# EAGLE design brain2_v12 (EAGLE 9.5.2)

## Sheet 1 of 2
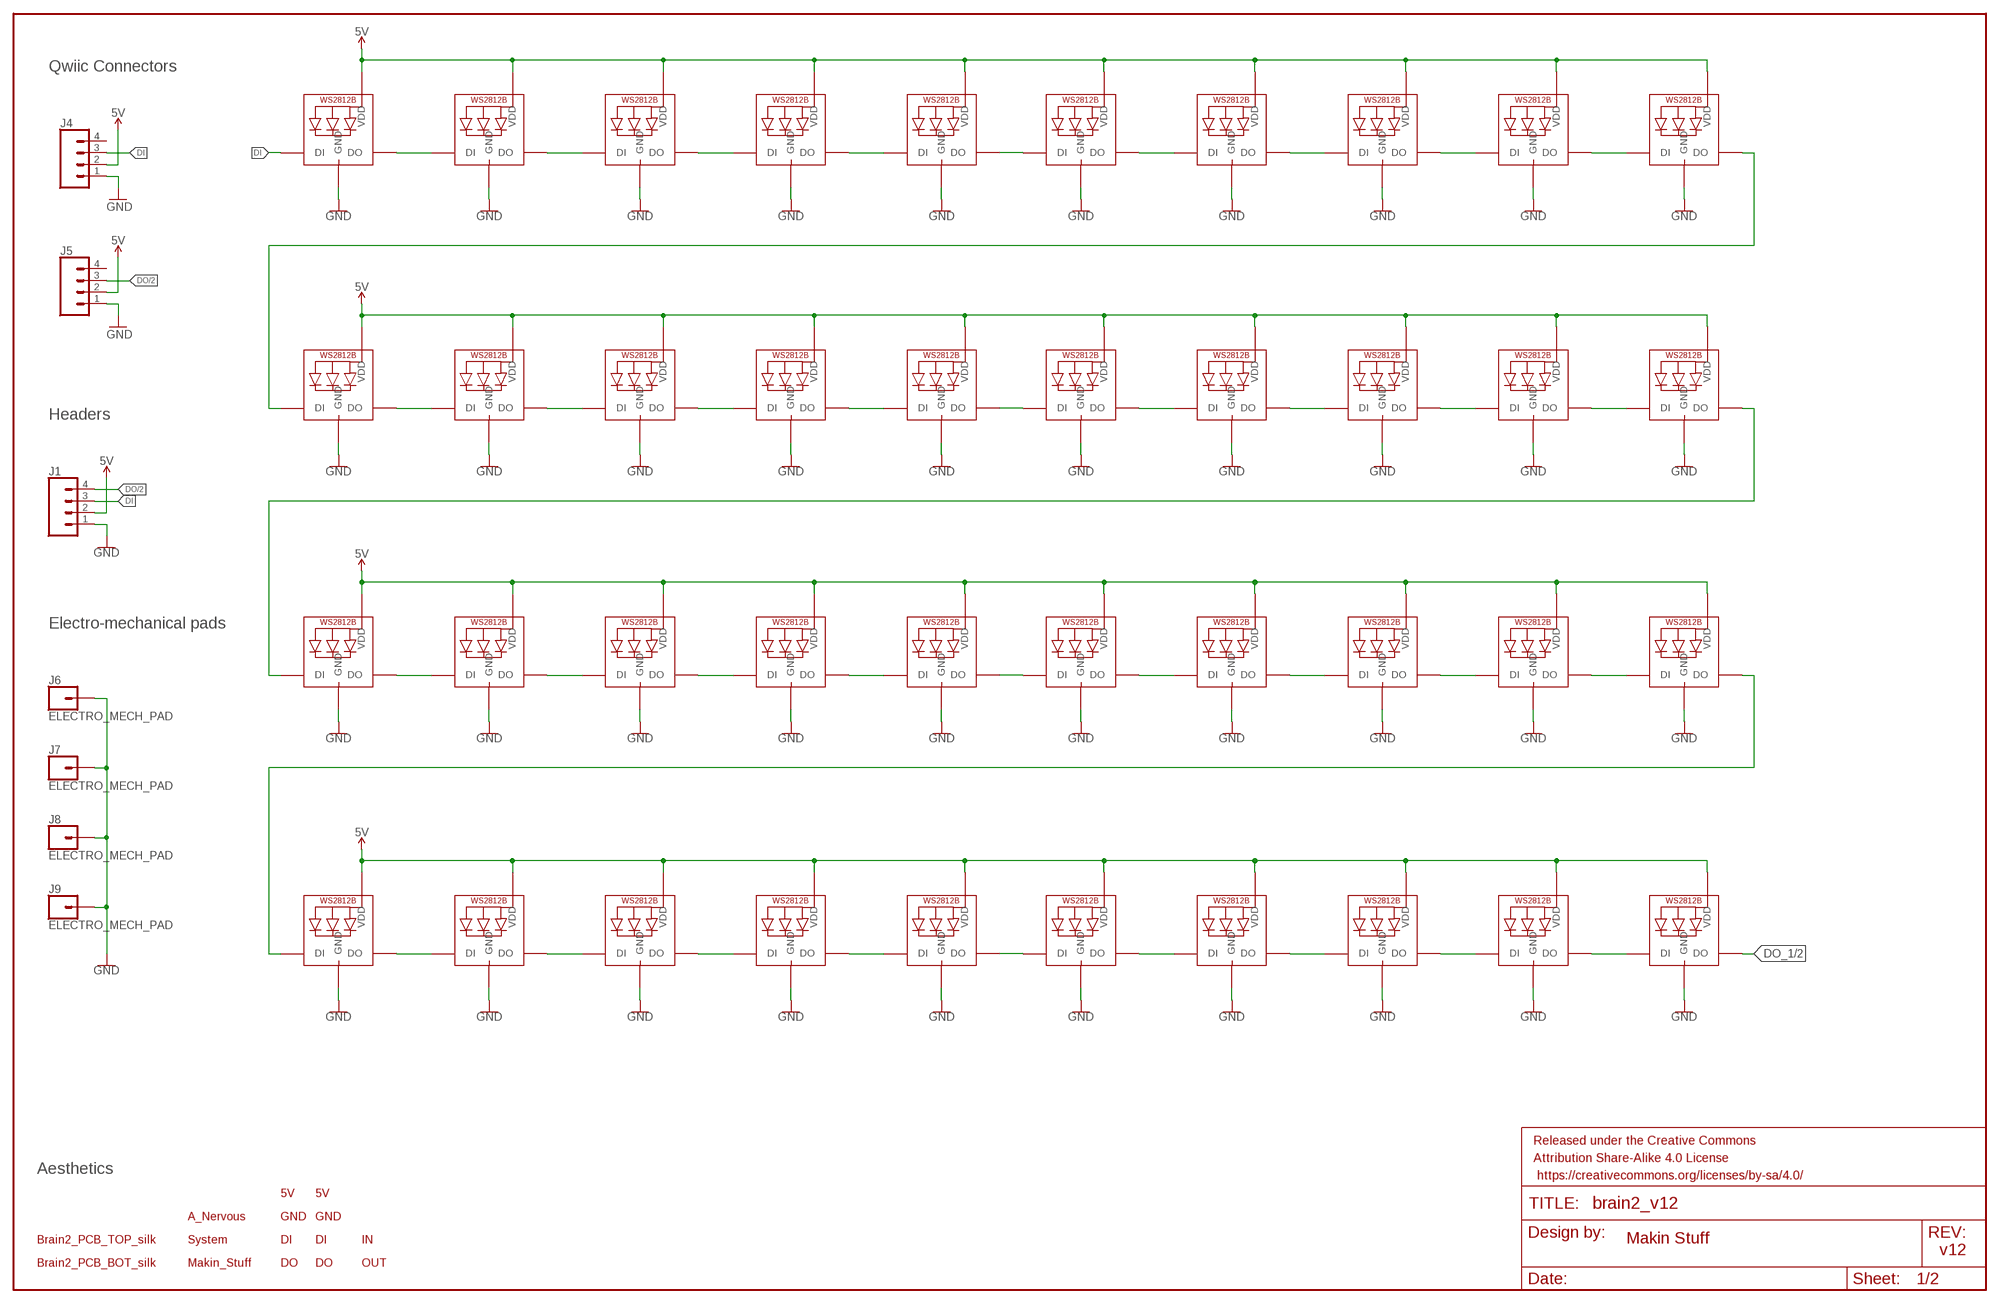
[diagram p0: schematic, sheet 1]

### Parts
FRAME2  FRAME-LEDGER  [CREATIVE_COMMONS]
J1  CONN_041X04_NO_SILK_NO_POP  [1X04_NO_SILK]
J4  CONN_04SMD3  [JST04_1MM_RA]
J5  CONN_04SMD3  [JST04_1MM_RA]
J6  ELECTRO_MECH_PAD  [5X3_SOLDER_PAD]
J7  ELECTRO_MECH_PAD  [5X3_SOLDER_PAD]
J8  ELECTRO_MECH_PAD  [5X3_SOLDER_PAD]
J9  ELECTRO_MECH_PAD  [5X3_SOLDER_PAD]
LED1  3.5X3.5_RGB_LED3.5X3.5  [3.5X3.5_RGB_LED]
LED2  3.5X3.5_RGB_LED3.5X3.5  [3.5X3.5_RGB_LED]
LED3  3.5X3.5_RGB_LED3.5X3.5  [3.5X3.5_RGB_LED]
LED4  3.5X3.5_RGB_LED3.5X3.5  [3.5X3.5_RGB_LED]
LED5  3.5X3.5_RGB_LED3.5X3.5  [3.5X3.5_RGB_LED]
LED6  3.5X3.5_RGB_LED3.5X3.5  [3.5X3.5_RGB_LED]
LED7  3.5X3.5_RGB_LED3.5X3.5  [3.5X3.5_RGB_LED]
LED8  3.5X3.5_RGB_LED3.5X3.5  [3.5X3.5_RGB_LED]
LED9  3.5X3.5_RGB_LED3.5X3.5  [3.5X3.5_RGB_LED]
LED10  3.5X3.5_RGB_LED3.5X3.5  [3.5X3.5_RGB_LED]
LED11  3.5X3.5_RGB_LED3.5X3.5  [3.5X3.5_RGB_LED]
LED12  3.5X3.5_RGB_LED3.5X3.5  [3.5X3.5_RGB_LED]
LED13  3.5X3.5_RGB_LED3.5X3.5  [3.5X3.5_RGB_LED]
LED14  3.5X3.5_RGB_LED3.5X3.5  [3.5X3.5_RGB_LED]
LED15  3.5X3.5_RGB_LED3.5X3.5  [3.5X3.5_RGB_LED]
LED16  3.5X3.5_RGB_LED3.5X3.5  [3.5X3.5_RGB_LED]
LED17  3.5X3.5_RGB_LED3.5X3.5  [3.5X3.5_RGB_LED]
LED18  3.5X3.5_RGB_LED3.5X3.5  [3.5X3.5_RGB_LED]
LED19  3.5X3.5_RGB_LED3.5X3.5  [3.5X3.5_RGB_LED]
LED20  3.5X3.5_RGB_LED3.5X3.5  [3.5X3.5_RGB_LED]
LED21  3.5X3.5_RGB_LED3.5X3.5  [3.5X3.5_RGB_LED]
LED22  3.5X3.5_RGB_LED3.5X3.5  [3.5X3.5_RGB_LED]
LED23  3.5X3.5_RGB_LED3.5X3.5  [3.5X3.5_RGB_LED]
LED24  3.5X3.5_RGB_LED3.5X3.5  [3.5X3.5_RGB_LED]
LED25  3.5X3.5_RGB_LED3.5X3.5  [3.5X3.5_RGB_LED]
LED26  3.5X3.5_RGB_LED3.5X3.5  [3.5X3.5_RGB_LED]
LED27  3.5X3.5_RGB_LED3.5X3.5  [3.5X3.5_RGB_LED]
LED28  3.5X3.5_RGB_LED3.5X3.5  [3.5X3.5_RGB_LED]
LED29  3.5X3.5_RGB_LED3.5X3.5  [3.5X3.5_RGB_LED]
LED30  3.5X3.5_RGB_LED3.5X3.5  [3.5X3.5_RGB_LED]
LED31  3.5X3.5_RGB_LED3.5X3.5  [3.5X3.5_RGB_LED]
LED32  3.5X3.5_RGB_LED3.5X3.5  [3.5X3.5_RGB_LED]
LED33  3.5X3.5_RGB_LED3.5X3.5  [3.5X3.5_RGB_LED]
LED34  3.5X3.5_RGB_LED3.5X3.5  [3.5X3.5_RGB_LED]
LED35  3.5X3.5_RGB_LED3.5X3.5  [3.5X3.5_RGB_LED]
LED36  3.5X3.5_RGB_LED3.5X3.5  [3.5X3.5_RGB_LED]
LED37  3.5X3.5_RGB_LED3.5X3.5  [3.5X3.5_RGB_LED]
LED38  3.5X3.5_RGB_LED3.5X3.5  [3.5X3.5_RGB_LED]
LED39  3.5X3.5_RGB_LED3.5X3.5  [3.5X3.5_RGB_LED]
LED40  3.5X3.5_RGB_LED3.5X3.5  [3.5X3.5_RGB_LED]
U$1  A_NERVOUS0  [A_NERVOUS0]
U$2  SYSTEM1  [SYSTEM1]
U$3  MAKIN_STUFF2  [MAKIN_STUFF2]
U$4  5V1  [5V1]
U$5  5V1  [5V1]
U$6  GND0  [GND0]
U$7  GND0  [GND0]
U$8  DI0  [DI0]
U$9  DI0  [DI0]
U$10  DO3  [DO3]
U$11  DO3  [DO3]
U$12  IN0  [IN0]
U$13  OUT1  [OUT1]
U$14  BRAIN2_PCB_TOP_SILK  [BRAIN2_PCB_TOP_SILK]
U$15  BRAIN2_PCB_BOT_SILK  [BRAIN2_PCB_BOT_SILK]

### Nets
5V: J1.2 J4.2 J5.2 LED1.4(VDD) LED2.4(VDD) LED3.4(VDD) LED4.4(VDD) LED5.4(VDD) LED6.4(VDD) LED7.4(VDD) LED8.4(VDD) LED9.4(VDD) LED10.4(VDD) LED11.4(VDD) LED12.4(VDD) LED13.4(VDD) LED14.4(VDD) LED15.4(VDD) LED16.4(VDD) LED17.4(VDD) LED18.4(VDD) LED19.4(VDD) LED20.4(VDD) LED21.4(VDD) LED22.4(VDD) LED23.4(VDD) LED24.4(VDD) LED25.4(VDD) LED26.4(VDD) LED27.4(VDD) LED28.4(VDD) LED29.4(VDD) LED30.4(VDD) LED31.4(VDD) LED32.4(VDD) LED33.4(VDD) LED34.4(VDD) LED35.4(VDD) LED36.4(VDD) LED37.4(VDD) LED38.4(VDD) LED39.4(VDD) LED40.4(VDD) ; also sheet 2
DI: J1.3 J4.3 LED1.3(DI)
DO: J1.4 J5.3 ; also sheet 2
DO_1: LED40.1(DO) ; also sheet 2
GND: J1.1 J4.1 J5.1 J6.P$1 J7.P$1 J8.P$1 J9.P$1 LED1.2(GND) LED2.2(GND) LED3.2(GND) LED4.2(GND) LED5.2(GND) LED6.2(GND) LED7.2(GND) LED8.2(GND) LED9.2(GND) LED10.2(GND) LED11.2(GND) LED12.2(GND) LED13.2(GND) LED14.2(GND) LED15.2(GND) LED16.2(GND) LED17.2(GND) LED18.2(GND) LED19.2(GND) LED20.2(GND) LED21.2(GND) LED22.2(GND) LED23.2(GND) LED24.2(GND) LED25.2(GND) LED26.2(GND) LED27.2(GND) LED28.2(GND) LED29.2(GND) LED30.2(GND) LED31.2(GND) LED32.2(GND) LED33.2(GND) LED34.2(GND) LED35.2(GND) LED36.2(GND) LED37.2(GND) LED38.2(GND) LED39.2(GND) LED40.2(GND) ; also sheet 2
N$1: LED1.1(DO) LED2.3(DI)
N$2: LED2.1(DO) LED3.3(DI)
N$3: LED3.1(DO) LED4.3(DI)
N$4: LED4.1(DO) LED5.3(DI)
N$5: LED6.1(DO) LED7.3(DI)
N$6: LED7.1(DO) LED8.3(DI)
N$7: LED8.1(DO) LED9.3(DI)
N$8: LED9.1(DO) LED10.3(DI)
N$9: LED11.1(DO) LED12.3(DI)
N$10: LED5.1(DO) LED6.3(DI)
N$11: LED12.1(DO) LED13.3(DI)
N$12: LED13.1(DO) LED14.3(DI)
N$13: LED14.1(DO) LED15.3(DI)
N$14: LED16.1(DO) LED17.3(DI)
N$15: LED17.1(DO) LED18.3(DI)
N$16: LED18.1(DO) LED19.3(DI)
N$17: LED19.1(DO) LED20.3(DI)
N$18: LED15.1(DO) LED16.3(DI)
N$19: LED21.1(DO) LED22.3(DI)
N$20: LED22.1(DO) LED23.3(DI)
N$21: LED23.1(DO) LED24.3(DI)
N$22: LED24.1(DO) LED25.3(DI)
N$23: LED26.1(DO) LED27.3(DI)
N$24: LED27.1(DO) LED28.3(DI)
N$25: LED28.1(DO) LED29.3(DI)
N$26: LED29.1(DO) LED30.3(DI)
N$27: LED25.1(DO) LED26.3(DI)
N$28: LED31.1(DO) LED32.3(DI)
N$29: LED32.1(DO) LED33.3(DI)
N$30: LED33.1(DO) LED34.3(DI)
N$31: LED34.1(DO) LED35.3(DI)
N$32: LED36.1(DO) LED37.3(DI)
N$33: LED37.1(DO) LED38.3(DI)
N$34: LED38.1(DO) LED39.3(DI)
N$35: LED39.1(DO) LED40.3(DI)
N$36: LED35.1(DO) LED36.3(DI)
N$37: LED10.1(DO) LED11.3(DI)
N$38: LED20.1(DO) LED21.3(DI)
N$39: LED30.1(DO) LED31.3(DI)
Unconnected: J4.4 J5.4

### Notes on the sheet
- Qwiic Connectors
- Headers
- Electro-mechanical pads
- Aesthetics
- Makin Stuff
- v12

## Sheet 2 of 2
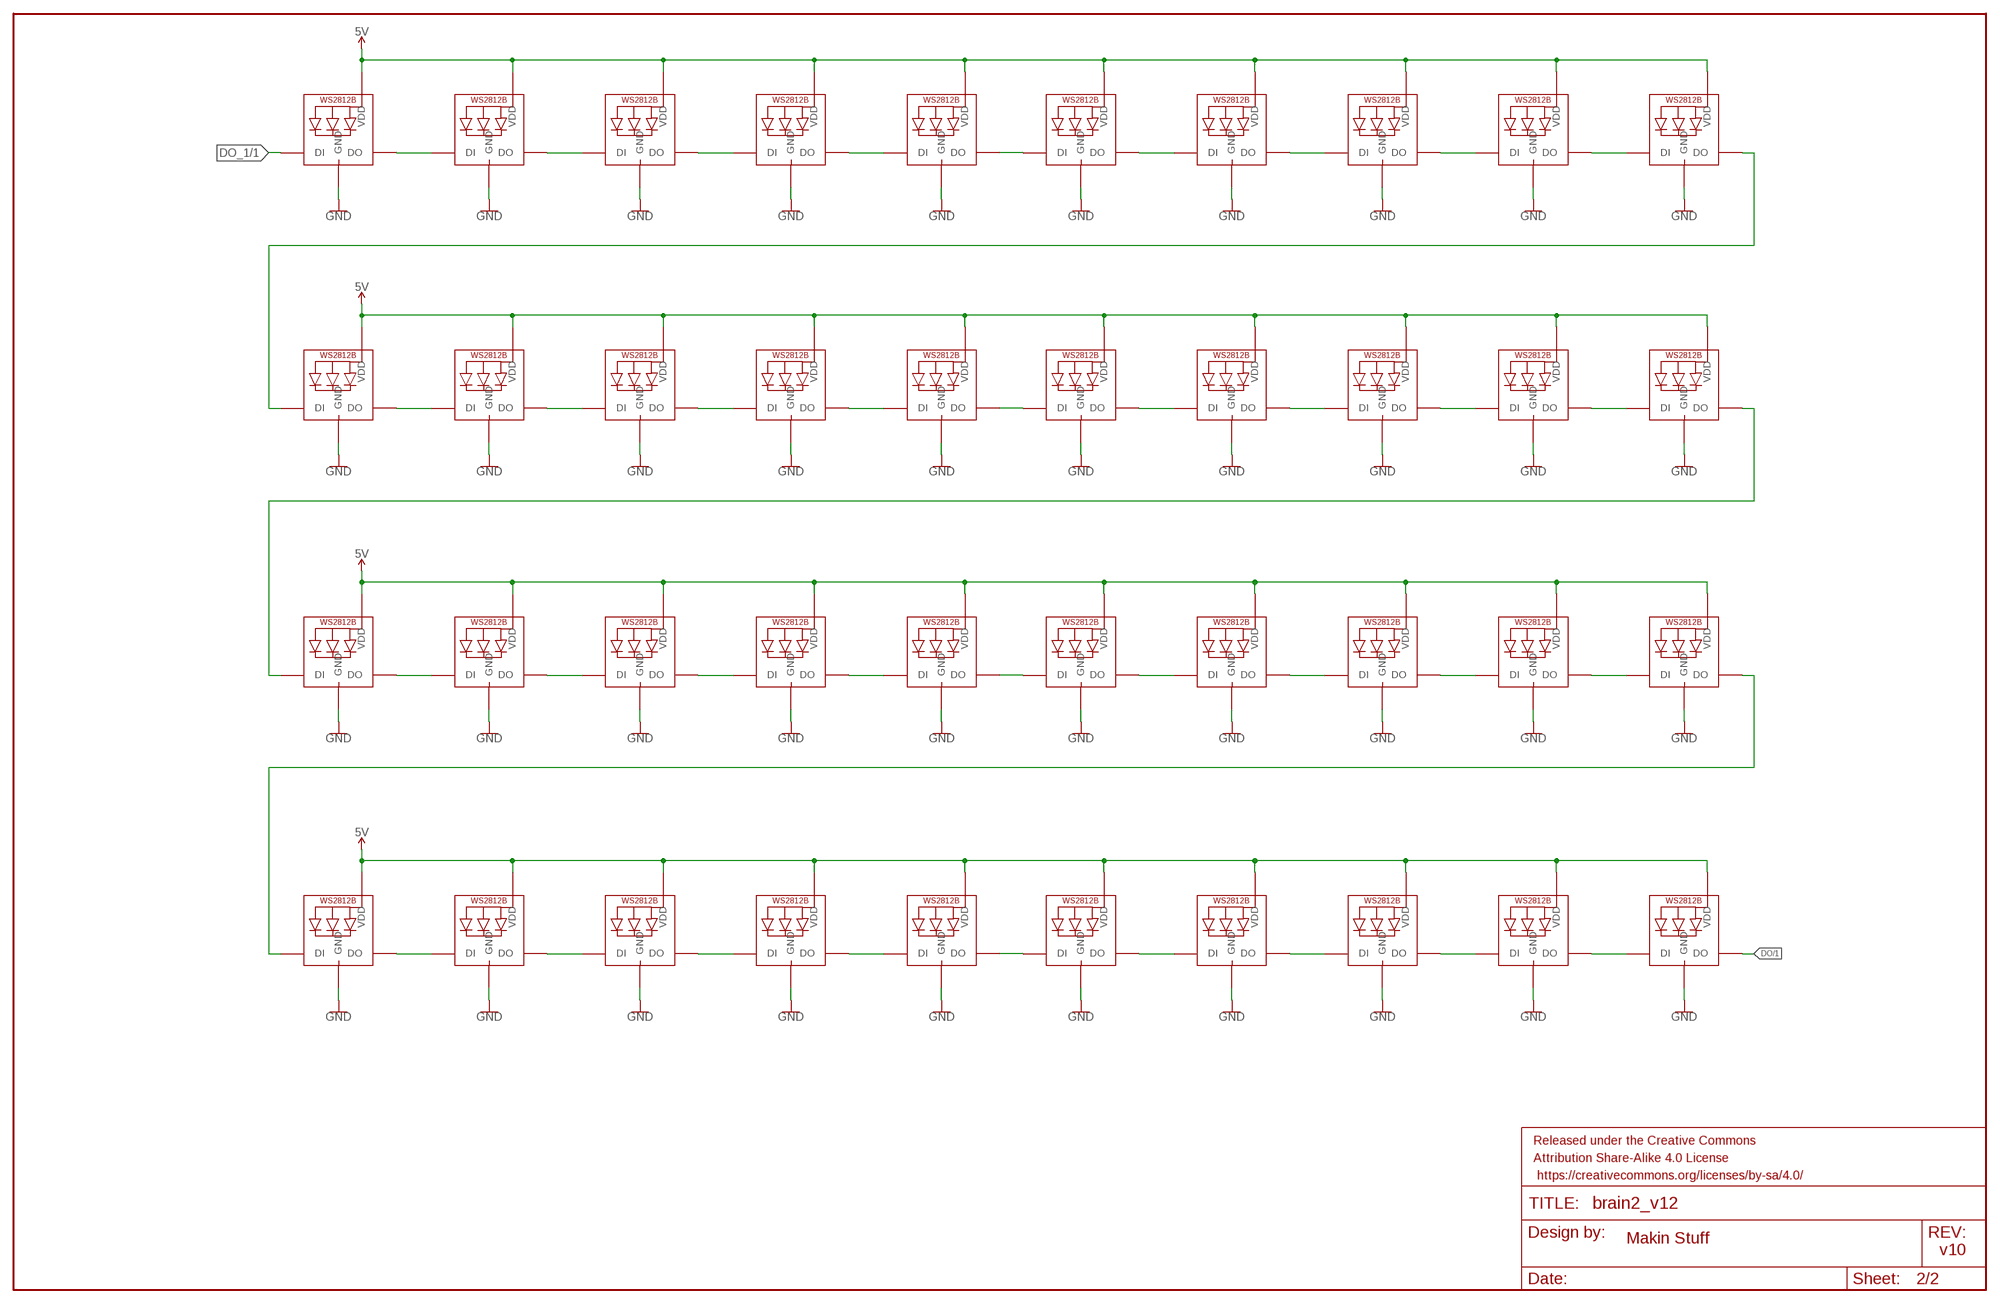
[diagram p1: schematic, sheet 2]

### Parts
FRAME1  FRAME-LEDGER  [CREATIVE_COMMONS]
FRAME3  FRAME-LEDGER  [CREATIVE_COMMONS]
LED41  3.5X3.5_RGB_LED3.5X3.5  [3.5X3.5_RGB_LED]
LED42  3.5X3.5_RGB_LED3.5X3.5  [3.5X3.5_RGB_LED]
LED43  3.5X3.5_RGB_LED3.5X3.5  [3.5X3.5_RGB_LED]
LED44  3.5X3.5_RGB_LED3.5X3.5  [3.5X3.5_RGB_LED]
LED45  3.5X3.5_RGB_LED3.5X3.5  [3.5X3.5_RGB_LED]
LED46  3.5X3.5_RGB_LED3.5X3.5  [3.5X3.5_RGB_LED]
LED47  3.5X3.5_RGB_LED3.5X3.5  [3.5X3.5_RGB_LED]
LED48  3.5X3.5_RGB_LED3.5X3.5  [3.5X3.5_RGB_LED]
LED49  3.5X3.5_RGB_LED3.5X3.5  [3.5X3.5_RGB_LED]
LED50  3.5X3.5_RGB_LED3.5X3.5  [3.5X3.5_RGB_LED]
LED51  3.5X3.5_RGB_LED3.5X3.5  [3.5X3.5_RGB_LED]
LED52  3.5X3.5_RGB_LED3.5X3.5  [3.5X3.5_RGB_LED]
LED53  3.5X3.5_RGB_LED3.5X3.5  [3.5X3.5_RGB_LED]
LED54  3.5X3.5_RGB_LED3.5X3.5  [3.5X3.5_RGB_LED]
LED55  3.5X3.5_RGB_LED3.5X3.5  [3.5X3.5_RGB_LED]
LED56  3.5X3.5_RGB_LED3.5X3.5  [3.5X3.5_RGB_LED]
LED57  3.5X3.5_RGB_LED3.5X3.5  [3.5X3.5_RGB_LED]
LED58  3.5X3.5_RGB_LED3.5X3.5  [3.5X3.5_RGB_LED]
LED59  3.5X3.5_RGB_LED3.5X3.5  [3.5X3.5_RGB_LED]
LED60  3.5X3.5_RGB_LED3.5X3.5  [3.5X3.5_RGB_LED]
LED61  3.5X3.5_RGB_LED3.5X3.5  [3.5X3.5_RGB_LED]
LED62  3.5X3.5_RGB_LED3.5X3.5  [3.5X3.5_RGB_LED]
LED63  3.5X3.5_RGB_LED3.5X3.5  [3.5X3.5_RGB_LED]
LED64  3.5X3.5_RGB_LED3.5X3.5  [3.5X3.5_RGB_LED]
LED65  3.5X3.5_RGB_LED3.5X3.5  [3.5X3.5_RGB_LED]
LED66  3.5X3.5_RGB_LED3.5X3.5  [3.5X3.5_RGB_LED]
LED67  3.5X3.5_RGB_LED3.5X3.5  [3.5X3.5_RGB_LED]
LED68  3.5X3.5_RGB_LED3.5X3.5  [3.5X3.5_RGB_LED]
LED69  3.5X3.5_RGB_LED3.5X3.5  [3.5X3.5_RGB_LED]
LED70  3.5X3.5_RGB_LED3.5X3.5  [3.5X3.5_RGB_LED]
LED71  3.5X3.5_RGB_LED3.5X3.5  [3.5X3.5_RGB_LED]
LED72  3.5X3.5_RGB_LED3.5X3.5  [3.5X3.5_RGB_LED]
LED73  3.5X3.5_RGB_LED3.5X3.5  [3.5X3.5_RGB_LED]
LED74  3.5X3.5_RGB_LED3.5X3.5  [3.5X3.5_RGB_LED]
LED75  3.5X3.5_RGB_LED3.5X3.5  [3.5X3.5_RGB_LED]
LED76  3.5X3.5_RGB_LED3.5X3.5  [3.5X3.5_RGB_LED]
LED77  3.5X3.5_RGB_LED3.5X3.5  [3.5X3.5_RGB_LED]
LED78  3.5X3.5_RGB_LED3.5X3.5  [3.5X3.5_RGB_LED]
LED79  3.5X3.5_RGB_LED3.5X3.5  [3.5X3.5_RGB_LED]
LED80  3.5X3.5_RGB_LED3.5X3.5  [3.5X3.5_RGB_LED]

### Nets
5V: LED41.4(VDD) LED42.4(VDD) LED43.4(VDD) LED44.4(VDD) LED45.4(VDD) LED46.4(VDD) LED47.4(VDD) LED48.4(VDD) LED49.4(VDD) LED50.4(VDD) LED51.4(VDD) LED52.4(VDD) LED53.4(VDD) LED54.4(VDD) LED55.4(VDD) LED56.4(VDD) LED57.4(VDD) LED58.4(VDD) LED59.4(VDD) LED60.4(VDD) LED61.4(VDD) LED62.4(VDD) LED63.4(VDD) LED64.4(VDD) LED65.4(VDD) LED66.4(VDD) LED67.4(VDD) LED68.4(VDD) LED69.4(VDD) LED70.4(VDD) LED71.4(VDD) LED72.4(VDD) LED73.4(VDD) LED74.4(VDD) LED75.4(VDD) LED76.4(VDD) LED77.4(VDD) LED78.4(VDD) LED79.4(VDD) LED80.4(VDD) ; also sheet 1
DO: LED80.1(DO) ; also sheet 1
DO_1: LED41.3(DI) ; also sheet 1
GND: LED41.2(GND) LED42.2(GND) LED43.2(GND) LED44.2(GND) LED45.2(GND) LED46.2(GND) LED47.2(GND) LED48.2(GND) LED49.2(GND) LED50.2(GND) LED51.2(GND) LED52.2(GND) LED53.2(GND) LED54.2(GND) LED55.2(GND) LED56.2(GND) LED57.2(GND) LED58.2(GND) LED59.2(GND) LED60.2(GND) LED61.2(GND) LED62.2(GND) LED63.2(GND) LED64.2(GND) LED65.2(GND) LED66.2(GND) LED67.2(GND) LED68.2(GND) LED69.2(GND) LED70.2(GND) LED71.2(GND) LED72.2(GND) LED73.2(GND) LED74.2(GND) LED75.2(GND) LED76.2(GND) LED77.2(GND) LED78.2(GND) LED79.2(GND) LED80.2(GND) ; also sheet 1
N$40: LED41.1(DO) LED42.3(DI)
N$41: LED42.1(DO) LED43.3(DI)
N$42: LED43.1(DO) LED44.3(DI)
N$43: LED44.1(DO) LED45.3(DI)
N$44: LED46.1(DO) LED47.3(DI)
N$45: LED47.1(DO) LED48.3(DI)
N$46: LED48.1(DO) LED49.3(DI)
N$47: LED49.1(DO) LED50.3(DI)
N$48: LED45.1(DO) LED46.3(DI)
N$49: LED51.1(DO) LED52.3(DI)
N$50: LED52.1(DO) LED53.3(DI)
N$51: LED53.1(DO) LED54.3(DI)
N$52: LED54.1(DO) LED55.3(DI)
N$53: LED56.1(DO) LED57.3(DI)
N$54: LED57.1(DO) LED58.3(DI)
N$55: LED58.1(DO) LED59.3(DI)
N$56: LED59.1(DO) LED60.3(DI)
N$57: LED55.1(DO) LED56.3(DI)
N$58: LED61.1(DO) LED62.3(DI)
N$59: LED62.1(DO) LED63.3(DI)
N$60: LED63.1(DO) LED64.3(DI)
N$61: LED64.1(DO) LED65.3(DI)
N$62: LED66.1(DO) LED67.3(DI)
N$63: LED67.1(DO) LED68.3(DI)
N$64: LED68.1(DO) LED69.3(DI)
N$65: LED69.1(DO) LED70.3(DI)
N$66: LED65.1(DO) LED66.3(DI)
N$67: LED71.1(DO) LED72.3(DI)
N$68: LED72.1(DO) LED73.3(DI)
N$69: LED73.1(DO) LED74.3(DI)
N$70: LED74.1(DO) LED75.3(DI)
N$71: LED76.1(DO) LED77.3(DI)
N$72: LED77.1(DO) LED78.3(DI)
N$73: LED78.1(DO) LED79.3(DI)
N$74: LED79.1(DO) LED80.3(DI)
N$75: LED75.1(DO) LED76.3(DI)
N$76: LED50.1(DO) LED51.3(DI)
N$77: LED60.1(DO) LED61.3(DI)
N$78: LED70.1(DO) LED71.3(DI)

### Notes on the sheet
- Makin Stuff
- v10

## Library data of the parts
FRAME1-FRAME3 = SparkFun-Aesthetics:FRAME-LEDGER: Schematic Frame - Ledger Standard 11x14 US Ledger frame
J1 = SparkFun-Connectors:CONN_04: Multi connection point. Often used as Generic Header-pin footprint for 0.1 inch spaced/style header connections On any of the 0.1 inch spaced packages, you can populate with these: Break Away Headers - Straight (PRT-00116) Break Away Male Headers - Right Angle (PRT-00553) Female Headers (PRT-00115) Break Away Headers - Machine Pin (PRT-00117) Break Away Female Headers - Swiss Machine Pin (PRT-00743) For SCREWTERMINALS and SPRING TERMINALS visit here: Screw Terimnals on SparkFun.com (5mm/3.5mm/2.54mm spacing) This device is also useful as a general connection point to wire up your design to another part of your project. Our various solder wires solder well into these plated through hole pads. Hook-Up Wire - Assortment (Stranded, 22 AWG) (PRT-11375) Hook-Up Wire - Assortment (Solid Core, 22 AWG) (PRT-11367) View the entire wire category on our website here Special notes: Molex polarized connector foot print use with SKU : PRT-08231 with associated crimp pins and housings. 1MM SMD Version SKU: PRT-10208
J4 J5 = SparkFun-Connectors:CONN_04: Multi connection point. Often used as Generic Header-pin footprint for 0.1 inch spaced/style header connections On any of the 0.1 inch spaced packages, you can populate with these: Break Away Headers - Straight (PRT-00116) Break Away Male Headers - Right Angle (PRT-00553) Female Headers (PRT-00115) Break Away Headers - Machine Pin (PRT-00117) Break Away Female Headers - Swiss Machine Pin (PRT-00743) For SCREWTERMINALS and SPRING TERMINALS visit here: Screw Terimnals on SparkFun.com (5mm/3.5mm/2.54mm spacing) This device is also useful as a general connection point to wire up your design to another part of your project. Our various solder wires solder well into these plated through hole pads. Hook-Up Wire - Assortment (Stranded, 22 AWG) (PRT-11375) Hook-Up Wire - Assortment (Solid Core, 22 AWG) (PRT-11367) View the entire wire category on our website here Special notes: Molex polarized connector foot print use with SKU : PRT-08231 with associated crimp pins and housings. 1MM SMD Version SKU: PRT-10208; COLOR: BLACK; PROD_ID: CONN-13694
J6-J9 = brain:ELECTRO_MECH_PAD
LED1-LED80 = brain:3.5X3.5_RGB_LED: This is a package for the 3.5x3.5MM Mini NeoPixel from Adafruit. The datasheet is here.
U$1 = brain:A_NERVOUS0
U$2 = brain:SYSTEM1
U$3 = brain:MAKIN_STUFF2
U$4 U$5 = brain:5V1
U$6 U$7 = brain:GND0
U$8 U$9 = brain:DI0
U$10 U$11 = brain:DO3
U$12 = brain:IN0
U$13 = brain:OUT1
U$14 = brain:BRAIN2_PCB_TOP_SILK
U$15 = brain:BRAIN2_PCB_BOT_SILK

## Board
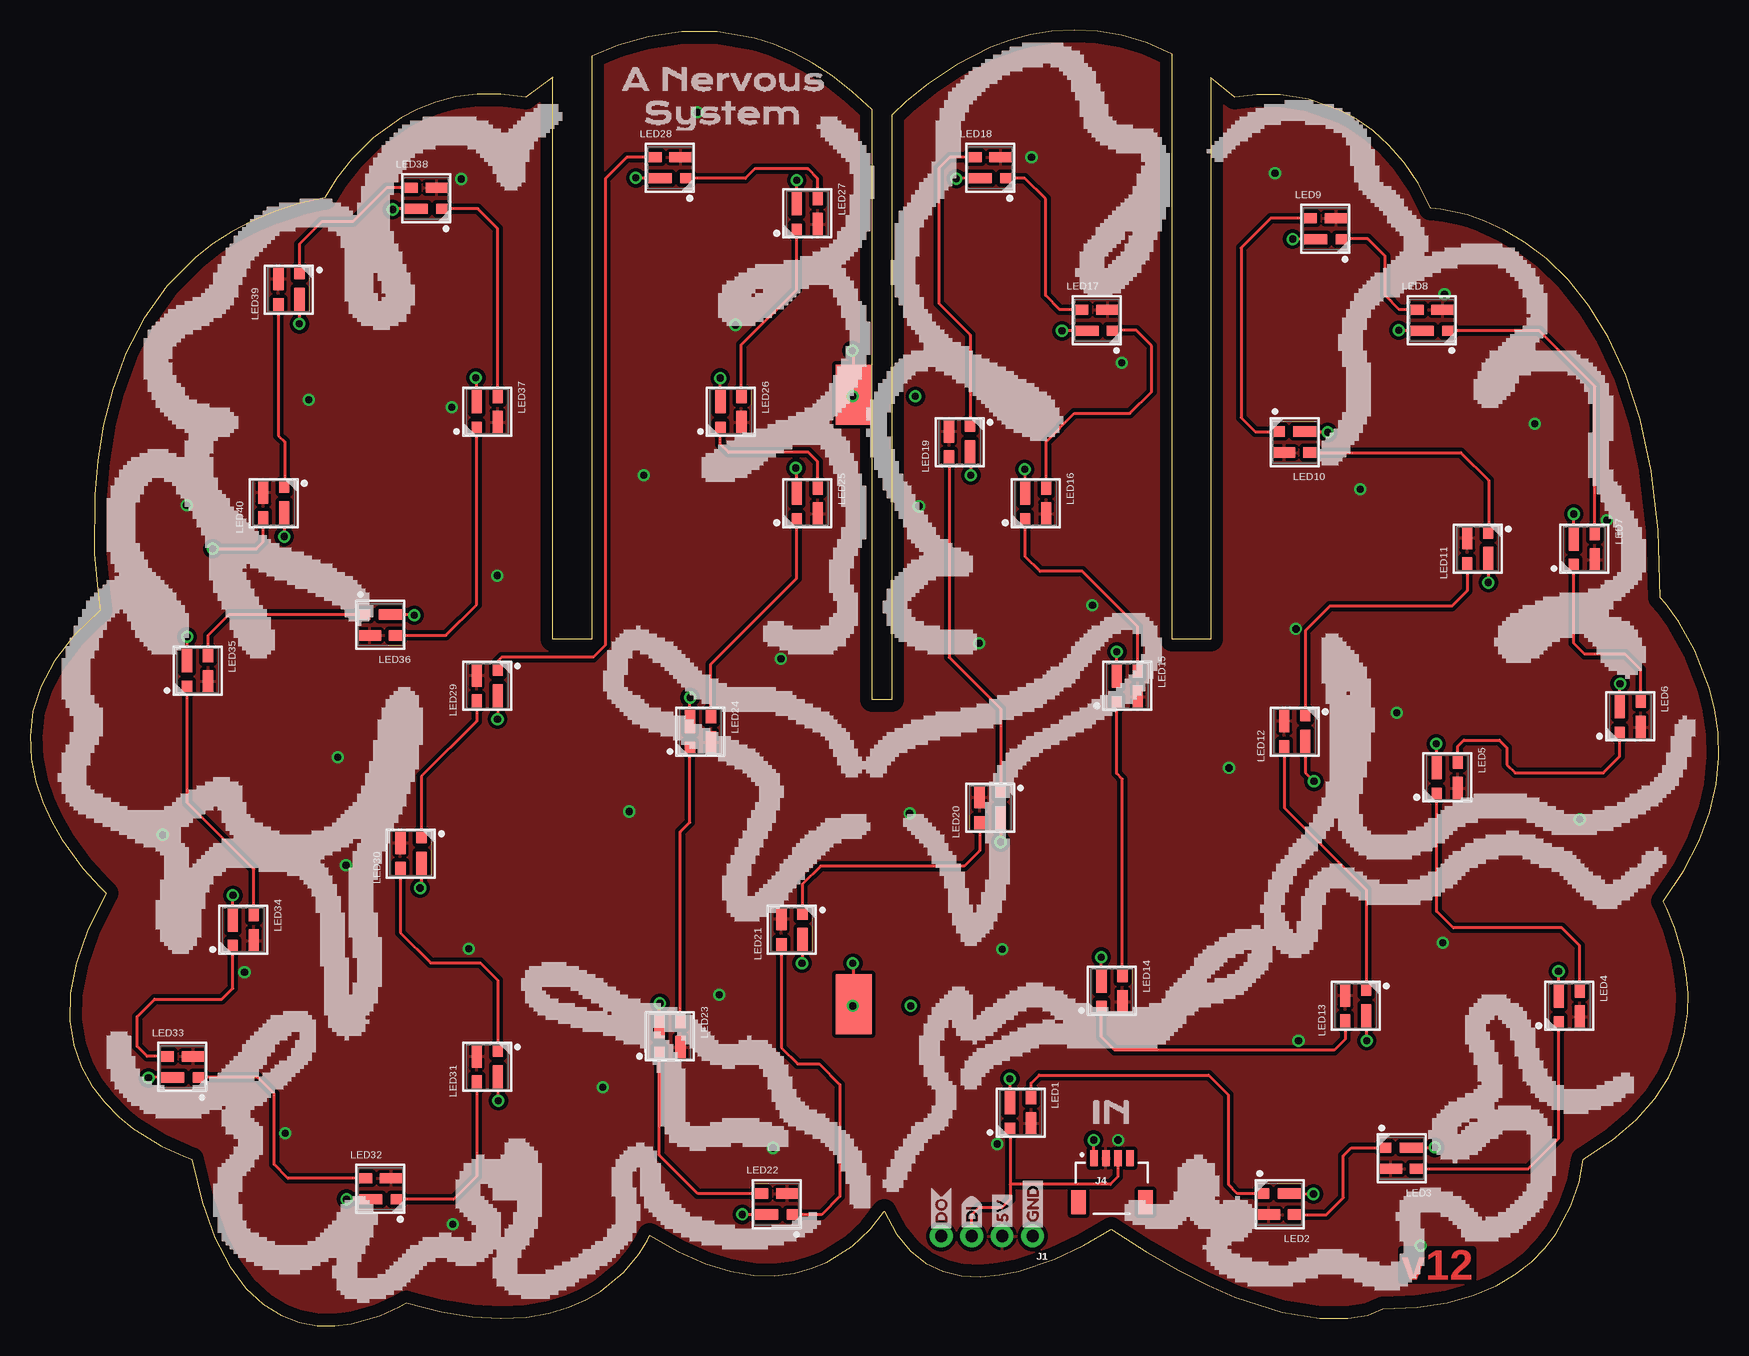
[diagram p2: board, top side]
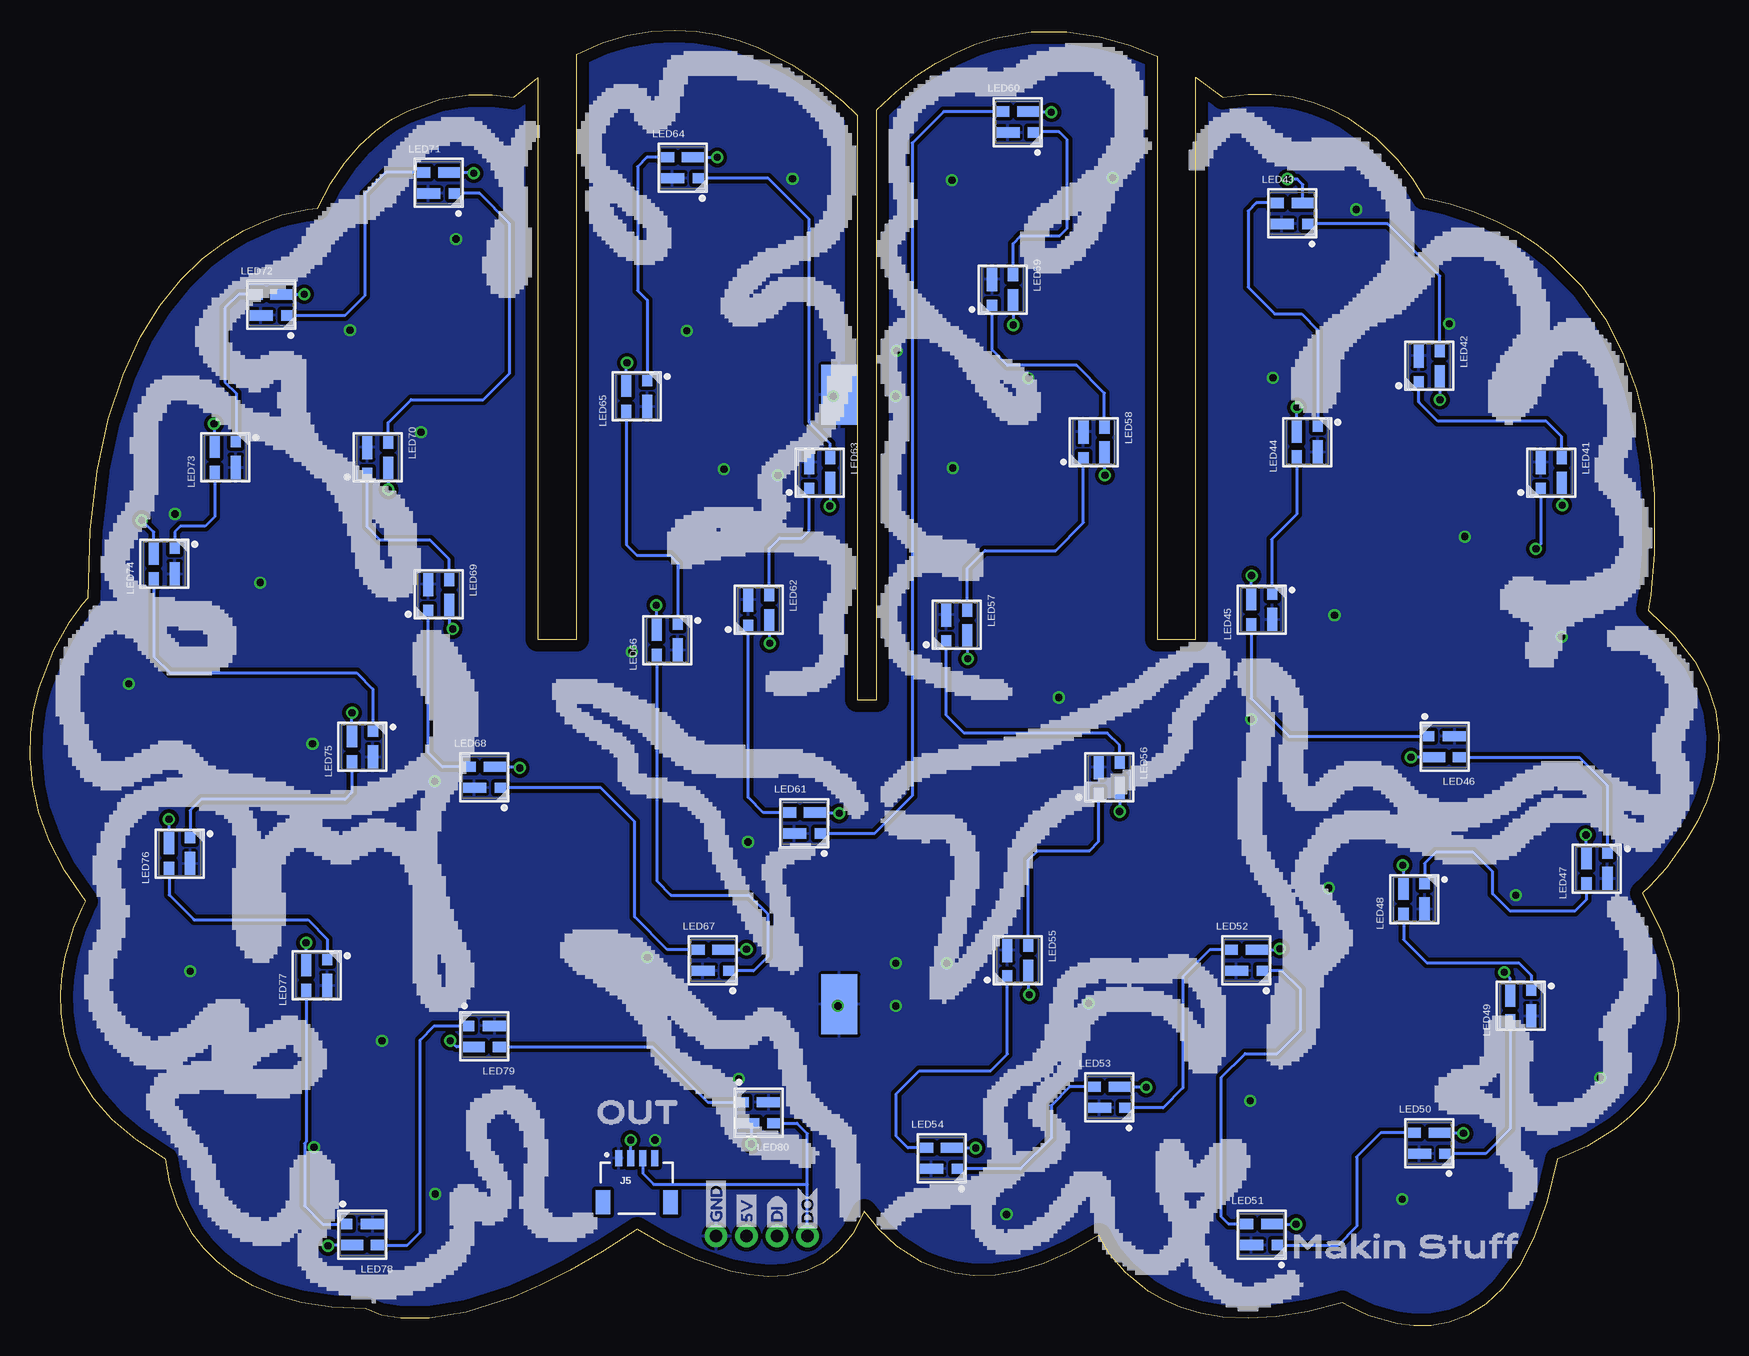
[diagram p3: board, bottom side, seen from below]

Size 140.73 x 107.98 mm. Coordinates in mm from the lower left corner, seen from the top.
Outline: 202 segments
Copper layers (1*16): Top 0.035mm / dielectric 1.5mm / Bottom 0.035mm
Design rules "default": minimum track width 6mil, minimum drill 0.35mm, track to track 6mil, track to pad 6mil, pad to pad 6mil, via to via 6mil, smd to smd 6mil, copper to edge 40mil, drill to drill 6mil, minimum pad ring 10mil, minimum via ring 8mil, stop-mask expansion 4mil, vias tented up to drill 0mil, thermal gap 10mil
tKeepout: area 43.6,-2.7 to 46.5,57.1; area 70.2,7.2 to 71.7,52.2; area 95.2,2.9 to 98.3,57.2
bKeepout: area 95.1,0.9 to 98.4,57.2; area 70.1,5.7 to 71.8,52.2; area 43.4,-2.2 to 46.8,57.2

### Footprints (pad centres in the part's own frame; a part is rotated, then mirrored left to right if it is on the bottom)
1X04_NO_SILK = drill 1.016 pad 1.88: 1 0,0; 2 2.54,0; 3 5.08,0; 4 7.62,0
JST04_1MM_RA = smd 0.6 x 1.35: 1 -1.5,0; 2 -0.5,0; 3 0.5,0; 4 1.5,0 | smd 1.2 x 2: NC1 2.8,-3.675; NC2 -2.8,-3.675
5X3_SOLDER_PAD = smd 5 x 3: P$1 0,0
3.5X3.5_RGB_LED = smd 1.15 x 0.85: 1 -1.275,0.875 | smd 2 x 0.85: 2 -0.85,-0.875 | smd 1 x 0.85: 3 1.35,-0.875 | smd 1.9 x 0.85: 4 0.9,0.875

### Placement (x,y rotation side)
FRAME1  -80.02,1.25 0 top  (outside the outline)
FRAME2  -80.02,10.14 0 top  (outside the outline)
FRAME3  -80.02,19.03 0 top  (outside the outline)
J1  83.56,7.48 180 top
J4  90.16,13.95 0 top
J5  90.16,13.95 0 bottom
J6  68.65,77.58 90 top
J7  68.65,26.78 90 top
J8  73.27,77.58 270 bottom
J9  73.27,26.78 270 bottom
LED1  82.54,17.76 270 top
LED2  104.13,10.14 180 top
LED3  114.29,13.95 180 top
LED4  128.26,26.65 270 top
LED5  118.1,45.7 270 top
LED6  133.34,50.78 270 top
LED7  129.53,64.75 270 top
LED8  116.83,83.8 0 top
LED9  107.94,91.42 0 top
LED10  105.4,73.64 180 top
LED11  120.64,64.75 90 top
LED12  105.4,49.51 90 top
LED13  110.48,26.65 90 top
LED14  90.16,27.92 270 top
LED15  91.43,53.32 270 top
LED16  83.81,68.56 270 top
LED17  88.89,83.8 0 top
LED18  80,96.5 0 top
LED19  77.46,73.64 90 top
LED20  80,43.16 90 top
LED21  63.49,33 90 top
LED22  62.22,10.14 0 top
LED23  53.33,24.11 270 top
LED24  55.87,49.51 270 top
LED25  64.76,68.56 270 top
LED26  58.41,76.18 270 top
LED27  64.76,92.69 270 top
LED28  53.33,96.5 0 top
LED29  38.09,53.32 90 top
LED30  31.74,39.35 90 top
LED31  38.09,21.57 90 top
LED32  29.2,11.41 0 top
LED33  12.69,21.57 0 top
LED34  17.77,33 270 top
LED35  13.96,54.59 270 top
LED36  29.2,58.4 180 top
LED37  38.09,76.18 270 top
LED38  33.01,93.96 0 top
LED39  21.58,86.34 90 top
LED40  20.31,68.56 90 top
LED41  13.96,71.1 270 bottom
LED42  24.12,79.99 270 bottom
LED43  35.55,92.69 0 bottom
LED44  34.28,73.64 90 bottom
LED45  38.09,59.67 90 bottom
LED46  22.85,48.24 180 bottom
LED47  10.15,38.08 90 bottom
LED48  25.39,35.54 90 bottom
LED49  16.5,26.65 90 bottom
LED50  24.12,15.22 0 bottom
LED51  38.09,7.6 0 bottom
LED52  39.36,30.46 0 bottom
LED53  50.79,19.03 0 bottom
LED54  64.76,13.95 0 bottom
LED55  58.41,30.46 270 bottom
LED56  50.79,45.7 270 bottom
LED57  63.49,58.4 270 bottom
LED58  52.06,73.64 270 bottom
LED59  59.68,86.34 270 bottom
LED60  58.41,100.31 0 bottom
LED61  76.19,41.89 0 bottom
LED62  80,59.67 270 bottom
LED63  74.92,71.1 270 bottom
LED64  86.35,96.5 0 bottom
LED65  90.16,77.45 90 bottom
LED66  87.62,57.13 90 bottom
LED67  83.81,30.46 0 bottom
LED68  102.86,45.7 0 bottom
LED69  106.67,60.94 270 bottom
LED70  111.75,72.37 270 bottom
LED71  106.67,95.23 0 bottom
LED72  120.64,85.07 0 bottom
LED73  124.45,72.37 90 bottom
LED74  129.53,63.48 90 bottom
LED75  113.02,48.24 90 bottom
LED76  128.26,39.35 90 bottom
LED77  116.83,29.19 90 bottom
LED78  113.02,7.6 180 bottom
LED79  102.86,24.11 180 bottom
LED80  80,17.76 180 bottom
U$1  47.74,103.87 0 top
U$2  49.52,101.07 0 top
U$3  37.2,6.59 0 bottom
U$4  81.02,7.73 90 top
U$5  81.02,7.73 90 bottom
U$6  83.56,7.73 90 top
U$7  83.56,7.73 90 bottom
U$8  78.48,7.73 90 top
U$9  78.48,7.73 90 bottom
U$10  75.94,7.6 90 top
U$11  75.94,7.6 90 bottom
U$12  86.86,17.76 0 top
U$13  95.12,17.76 0 bottom
U$14  69.84,54.59 0 top
U$15  70.35,54.21 0 bottom

### Tracks (layer width: path | path; a pad name or v marks a point on that pad's centre or on a via)
5V  (via drill 0.6)
  Bottom 0.254: LED41.4 13.09,68.42 v13.05,68.38 | LED42.4 23.25,77.19 v23.23,77.17 | LED43.4 34.65,95.09 35.12,95.56 v35.93,95.56 | LED44.4 35.16,76.53 v35.15,76.54 | LED45.4 38.97,62.48 v38.93,62.52 | LED46.4 25.64,47.37 v25.65,47.38 | LED47.4 11.03,40.86 v11.07,40.9 | LED48.4 26.27,38.32 v26.33,38.39 | LED49.4 17.38,28.95 v17.87,29.45 | LED50.4 21.34,16.1 v21.28,16.04 | LED51.4 35.23,8.48 v35.22,8.47 | LED52.4 36.66,31.34 v36.57,31.43 | LED53.4 47.76,19.91 v47.72,19.87 | LED54.4 61.93,14.83 v61.92,14.82 | LED55.4 57.54,27.68 v57.45,27.59 | LED56.4 49.92,42.87 v49.93,42.86 | LED57.4 62.62,55.62 v62.58,55.58 | LED58.4 51.19,70.91 v51.15,70.87 | LED59.4 58.81,83.41 v58.79,83.4 | LED60.4 55.68,101.19 v55.62,101.13 | LED61.4 73.36,42.77 v73.3,42.71 | LED62.4 79.13,56.92 v79.09,56.88 | LED63.4 74.05,68.35 v74.08,68.31 | LED64.4 83.47,97.38 v83.46,97.37 | LED65.4 91.04,80.18 v90.98,80.25 | LED66.4 88.5,60.01 v88.54,60.05 | LED67.4 81.06,31.34 v81.02,31.38 | LED68.4 100,46.58 v99.92,46.49 | LED69.4 105.8,58.37 v105.49,58.07 | LED70.4 110.88,69.72 v110.86,69.71 | LED71.4 103.81,96.11 v103.75,96.05 | LED72.4 117.89,85.95 v117.87,85.96 | LED73.4 125.33,75.1 v125.39,75.17 | LED74.4 130.41,66.14 v131.41,67.14 | LED75.4 113.9,51.08 v113.89,51.09 | LED76.4 129.14,42.21 v129.15,42.22 | LED77.4 117.71,31.9 v117.72,31.91 | LED78.4 115.83,6.73 v115.89,6.66 | LED79.4 105.19,23.24 v105.71,23.76 | LED80.4 80.61,16.6 v80.61,15.15 | J5.2 v90.66,15.47 v90.67,15.48
  pour Top (isolate 0.305): -0.01,-0.02 -0.01,107.93 140.96,107.93 140.96,-0.02
DI
  Top 0.254: LED1.3 81.67,11.79 | 81.67,11.79 81.67,10.52 81.03,9.89 79.11,9.89 78.48,9.25 J1.3 | J4.3 90.66,12.42 90.04,11.79 81.67,11.79
DO
  Bottom 0.254: LED80.1 76.82,16.89 75.94,16 75.94,11.79 | J1.4 75.94,11.79 | J5.3 89.66,12.69 88.77,11.79 75.94,11.79
DO_1  (via drill 0.6)
  Top 0.254: v15.23,64.75 18.86,64.75 19.44,65.33 LED40.1
  Bottom 0.254: LED41.3 14.84,65.15 v15.23,64.75
GND  (via drill 0.6)
  Top 0.254: LED1.2 81.67,20.57 v81.65,20.58 | LED2.2 106.92,11.02 v106.95,10.98 | LED3.2 117.02,14.83 v117.06,14.87 | LED4.2 127.39,29.53 v127.37,29.55 | LED5.2 117.23,48.46 v117.19,48.5 | LED6.2 132.47,53.46 v132.5,53.5 | LED7.2 128.66,67.63 v128.64,67.65 | LED8.2 114.1,82.93 v114.06,82.96 | LED9.2 105.24,90.55 v105.22,90.56 | LED10.2 108.08,74.52 v108.15,74.46 | LED11.2 121.52,61.95 v121.53,61.93 | LED13.2 111.36,23.8 v111.4,23.76 | LED14.2 89.29,30.7 v89.27,30.72 | LED15.2 90.56,56.16 v90.57,56.17 | LED16.2 82.94,71.34 v82.9,71.38 | LED17.2 86.01,82.93 v86,82.91 | LED18.2 77.22,95.63 v77.18,95.59 | LED19.2 78.4,72.73 v78.4,70.87 | LED20.2 80.88,40.33 v80.89,40.32 | LED21.2 64.37,30.25 v64.33,30.21 | LED22.2 59.36,9.27 v59.35,9.28 | LED23.2 52.46,26.84 v52.49,26.88 | LED24.2 55,52.35 v55.01,52.36 | LED25.2 63.89,71.42 v63.82,71.48 | LED26.2 57.54,78.96 v57.52,78.98 | LED27.2 63.89,95.45 v63.9,95.46 | LED28.2 50.52,95.63 v50.49,95.66 | LED29.2 38.97,50.57 v38.96,50.55 | LED30.2 32.62,36.6 v32.5,36.48 | LED31.2 38.97,18.82 v39.03,18.75 | LED32.2 26.39,10.54 v26.38,10.55 | LED33.2 9.91,20.7 v9.87,20.66 | LED34.2 16.9,35.86 v16.91,35.87 | LED35.2 13.09,57.4 v13.1,57.41 | LED36.2 31.96,59.28 v32.02,59.22 | LED37.2 37.22,78.94 v37.15,79 | LED38.2 30.28,93.09 v30.22,93.02 | LED39.2 22.46,83.51 v22.45,83.5 | LED40.2 21.19,65.78 v21.18,65.77 | LED12.2 106.28,46.1 v107,45.37 | J4.1 88.66,15.45 v88.64,15.48 | J7.P$1 68.65,30.13 v68.57,30.21 | J6.P$1 68.65,81.12 v68.51,81.26
  other vias: 68.57,26.65 73.4,26.65 68.57,77.45 73.78,77.45
  pour Bottom (isolate 0.305): -0.01,-0.02 -0.01,107.93 140.96,107.93 140.96,-0.02
N$1
  Top 0.254: LED1.1 83.42,20.21 84.09,20.89 98.21,20.89 99.86,19.24 99.86,11.78 100.62,11.02 LED2.3
N$2
  Top 0.254: LED2.1 108.03,9.27 109.44,10.68 109.44,14.16 110.11,14.83 LED3.3
N$3
  Top 0.254: LED3.1 124.85,13.08 127.39,15.62 LED4.3
N$4
  Top 0.254: LED4.1 129.14,31.67 127.65,33.15 118.61,33.15 117.23,34.54 LED5.3
N$5
  Top 0.254: LED6.1 134.22,54.68 132.94,55.96 129.56,55.96 128.66,56.86 LED7.3
N$6
  Top 0.254: LED7.1 130.41,78.28 125.76,82.93 LED8.3
N$7
  Top 0.254: LED9.3 109.33,90.58 111.47,90.58 112.92,89.14 112.92,85.86 114.1,84.68 LED8.1
N$8
  Top 0.254: LED9.1 103.41,92.3 100.93,89.82 100.93,75.67 102.1,74.51 LED10.3
N$9
  Top 0.254: LED11.1 119.77,61.26 118.48,59.98 108.32,59.98 106.28,57.93 LED12.3
N$10
  Top 0.254: LED5.1 118.98,48.28 119.5,48.8 122.45,48.8 123.08,48.17 123.08,46.77 123.77,46.08 131.11,46.08 132.47,47.44 LED6.3
N$11
  Top 0.254: LED12.1 104.53,43.15 111.36,36.32 LED13.3
N$12
  Top 0.254: LED13.1 109.61,23.9 108.68,22.97 90.39,22.97 89.29,24.07 LED14.3
N$13
  Top 0.254: LED14.1 91.04,45.56 90.56,46.04 LED15.3
N$14
  Top 0.254: LED16.1 84.69,73.68 87.04,76.03 91.66,76.03 93.46,77.83 93.46,81.67 92.17,82.96 90.28,82.96 LED17.3
N$15
  Top 0.254: LED17.1 85.81,84.68 84.63,85.86 84.63,93.91 82.91,95.63 LED18.3
N$16
  Top 0.254: LED18.1 76.66,97.38 75.74,96.45 75.74,85.2 78.35,82.58 78.35,75.01 LED19.3
N$17
  Top 0.254: LED19.1 76.59,55.7 80.88,51.41 LED20.3
N$18
  Top 0.254: LED15.1 92.31,58.26 87.7,62.87 84.17,62.87 82.94,64.1 LED16.3
N$19
  Top 0.254: LED21.1 62.62,23.18 63.98,21.83 65.75,21.83 67.48,20.1 67.48,10.78 65.97,9.27 LED22.3
N$20
  Top 0.254: LED22.1 55.66,11.02 52.46,14.22 LED23.3
N$21
  Top 0.254: LED23.1 54.21,41.17 55,41.96 LED24.3
N$22
  Top 0.254: LED24.1 56.75,55.14 63.89,62.28 LED25.3
N$23
  Top 0.254: LED26.1 59.29,81.76 63.89,86.36 LED27.3
N$24
  Top 0.254: LED27.1 65.64,95.6 64.84,96.4 60.39,96.4 59.62,95.63 LED28.3
N$25
  Top 0.254: LED28.1 49.74,97.38 47.95,95.59 47.95,56.73 46.95,55.72 39.33,55.72 38.97,55.36 LED29.3
N$26
  Top 0.254: LED29.1 37.22,50.39 32.62,45.79 LED30.3
N$27
  Top 0.254: LED25.1 65.64,72.01 64.86,72.78 58.21,72.78 57.54,73.45 LED26.3
N$28
  Top 0.254: LED31.1 37.22,12.44 35.31,10.54 LED32.3
N$29
  Top 0.254: LED32.1 21.49,12.29 20.34,13.44 20.34,19.34 18.98,20.7 LED33.3
N$30
  Top 0.254: LED33.1 9.76,22.45 8.93,23.27 8.93,25.76 10.38,27.21 15.99,27.21 16.9,28.11 LED34.3
N$31
  Top 0.254: LED34.1 18.65,38.05 13.09,43.61 LED35.3
N$32
  Top 0.254: LED36.1 34.65,57.53 37.22,60.09 LED37.3
N$33
  Top 0.254: LED37.1 38.97,91.44 37.32,93.09 LED38.3
N$34
  Top 0.254: LED38.1 29.75,94.84 26.92,92.01 24.33,92.01 22.46,90.14 LED39.3
N$35
  Top 0.254: LED39.1 20.71,74.19 21.23,73.67 21.23,69.95 LED40.3
N$36
  Top 0.254: LED35.1 14.84,57.52 16.6,59.29 27.84,59.29 LED36.3
N$37
  Top 0.254: LED10.1 119.23,72.77 121.56,70.44 121.56,66.14 LED11.3
N$38
  Top 0.254: LED20.1 79.13,39.6 77.84,38.31 65.88,38.31 64.37,36.8 LED21.3
N$39
  Top 0.254: LED30.1 30.87,32.76 33.39,30.23 37.53,30.23 38.97,28.8 LED31.3
N$40
  Bottom 0.254: LED41.1 13.09,74.09 14.39,75.4 23.41,75.4 25,76.98 LED42.3
N$41
  Bottom 0.254: LED42.1 23.25,87.47 27.59,91.82 LED43.3
N$42
  Bottom 0.254: LED43.1 38.54,93.57 39.21,92.9 39.21,86.55 37,84.34 34.77,84.34 33.41,82.98 LED44.3
N$43
  Bottom 0.254: LED44.1 35.16,67.64 37.25,65.54 37.25,61.06 LED45.3
N$44
  Bottom 0.254: LED46.1 11.61,47.37 9.28,45.03 LED47.3
N$45
  Bottom 0.254: LED47.1 11.03,35.51 11.98,34.55 17.39,34.55 18.84,36 18.84,37.85 20.44,39.45 23.59,39.45 24.52,38.53 LED48.3
N$46
  Bottom 0.254: LED48.1 26.27,32.18 24.33,30.23 16.65,30.23 15.63,29.21 LED49.3
N$47
  Bottom 0.254: LED49.1 17.38,16.4 19.43,14.35 LED50.3
N$48
  Bottom 0.254: LED45.1 38.97,52.29 35.79,49.12 LED46.3
N$49
  Bottom 0.254: LED51.1 40.85,8.48 41.45,9.08 41.45,20.71 39.46,22.69 36.8,22.69 34.84,24.65 34.84,28.02 36.4,29.59 LED52.3
N$50
  Bottom 0.254: LED52.1 42.4,31.34 44.65,29.09 44.65,19.82 46.31,18.16 LED53.3
N$51
  Bottom 0.254: LED53.1 54.08,19.91 55.64,18.35 55.64,15.63 58.2,13.08 LED54.3
N$52
  Bottom 0.254: LED54.1 67.57,14.83 68.52,15.78 68.52,19.34 66.62,21.24 60.67,21.24 59.29,22.63 LED55.3
N$53
  Bottom 0.254: LED56.1 49.92,48.36 50.94,49.39 62.88,49.39 64.37,50.87 LED57.3
N$54
  Bottom 0.254: LED57.1 62.62,63.14 61.16,64.6 55.26,64.6 52.94,66.93 LED58.3
N$55
  Bottom 0.254: LED58.1 51.19,77.72 53.51,80.04 59.28,80.04 60.56,81.32 LED59.3
N$56
  Bottom 0.254: LED59.1 58.81,90.19 58.16,90.84 54.91,90.84 54.3,91.45 54.3,98.84 54.96,99.5 57,99.5 LED60.3
N$57
  Bottom 0.254: LED55.1 57.54,38.83 56.76,39.61 52.42,39.61 51.67,40.36 LED56.3
N$58
  Bottom 0.254: LED61.1 79.61,42.77 80.88,44.04 LED62.3
N$59
  Bottom 0.254: LED62.1 79.13,64.76 78.25,65.64 76.42,65.64 75.8,66.27 LED63.3
N$60
  Bottom 0.254: LED63.1 74.05,73.52 75.83,75.3 75.83,92.25 79.2,95.63 LED64.3
N$61
  Bottom 0.254: LED64.1 89.31,97.38 90.09,96.6 90.09,86.27 89.29,85.47 LED65.3
N$62
  Bottom 0.254: LED66.1 88.5,37.08 87.32,35.9 80.84,35.9 79.27,34.32 79.27,30.74 80.43,29.57 82.45,29.57 LED67.3
N$63
  Bottom 0.254: LED67.1 87.61,31.34 90.34,34.07 90.34,42.02 93.15,44.83 LED68.3
N$64
  Bottom 0.254: LED68.1 106.35,46.58 107.55,47.77 LED69.3
N$65
  Bottom 0.254: LED69.1 105.8,63.88 107.38,65.46 111.52,65.46 112.63,66.57 LED70.3
N$66
  Bottom 0.254: LED65.1 91.04,65.07 90.16,64.19 87.39,64.19 86.75,63.55 LED66.3
N$67
  Bottom 0.254: LED71.1 111.08,96.11 112.84,94.34 112.84,85.83 114.5,84.18 119.28,84.18 LED72.3
N$68
  Bottom 0.254: LED72.1 123.35,85.95 124.48,84.82 124.48,78.65 123.54,77.71 123.54,73.76 LED73.3
N$69
  Bottom 0.254: LED73.1 125.33,67.43 126.13,66.63 128.19,66.63 128.66,66.16 LED74.3
N$70
  Bottom 0.254: LED74.1 130.41,55.77 129.05,54.41 113.51,54.41 112.15,53.06 LED75.3
N$71
  Bottom 0.254: LED76.1 129.14,35.91 127.04,33.82 117.54,33.82 115.96,32.23 LED77.3
N$72
  Bottom 0.254: LED77.1 117.71,15.33 117.84,15.19 117.84,9.99 116.32,8.47 114.38,8.47 LED78.3
N$73
  Bottom 0.254: LED78.1 109.27,6.73 108.22,7.78 108.22,23.81 107.04,24.99 LED79.3
N$74
  Bottom 0.254: LED79.1 88.86,23.24 84.26,18.64 LED80.3
N$75
  Bottom 0.254: LED75.1 113.9,44.45 114.47,43.87 126.46,43.87 127.39,42.95 LED76.3
N$76
  Bottom 0.254: LED50.1 28.15,16.1 30.17,14.08 30.17,8.29 31.77,6.69 36.7,6.69 LED51.3
N$77
  Bottom 0.254: LED60.1 64.6,101.19 67.23,98.56 67.23,44.15 70.36,41.02 LED61.3
N$78
  Bottom 0.254: LED70.1 110.88,75.25 108.96,77.17 102.94,77.17 100.75,79.36 100.75,91.85 103.26,94.36 LED71.3

### Text on the board
Top: v12